# EAGLE schematic schematic (EAGLE 9.5.2)
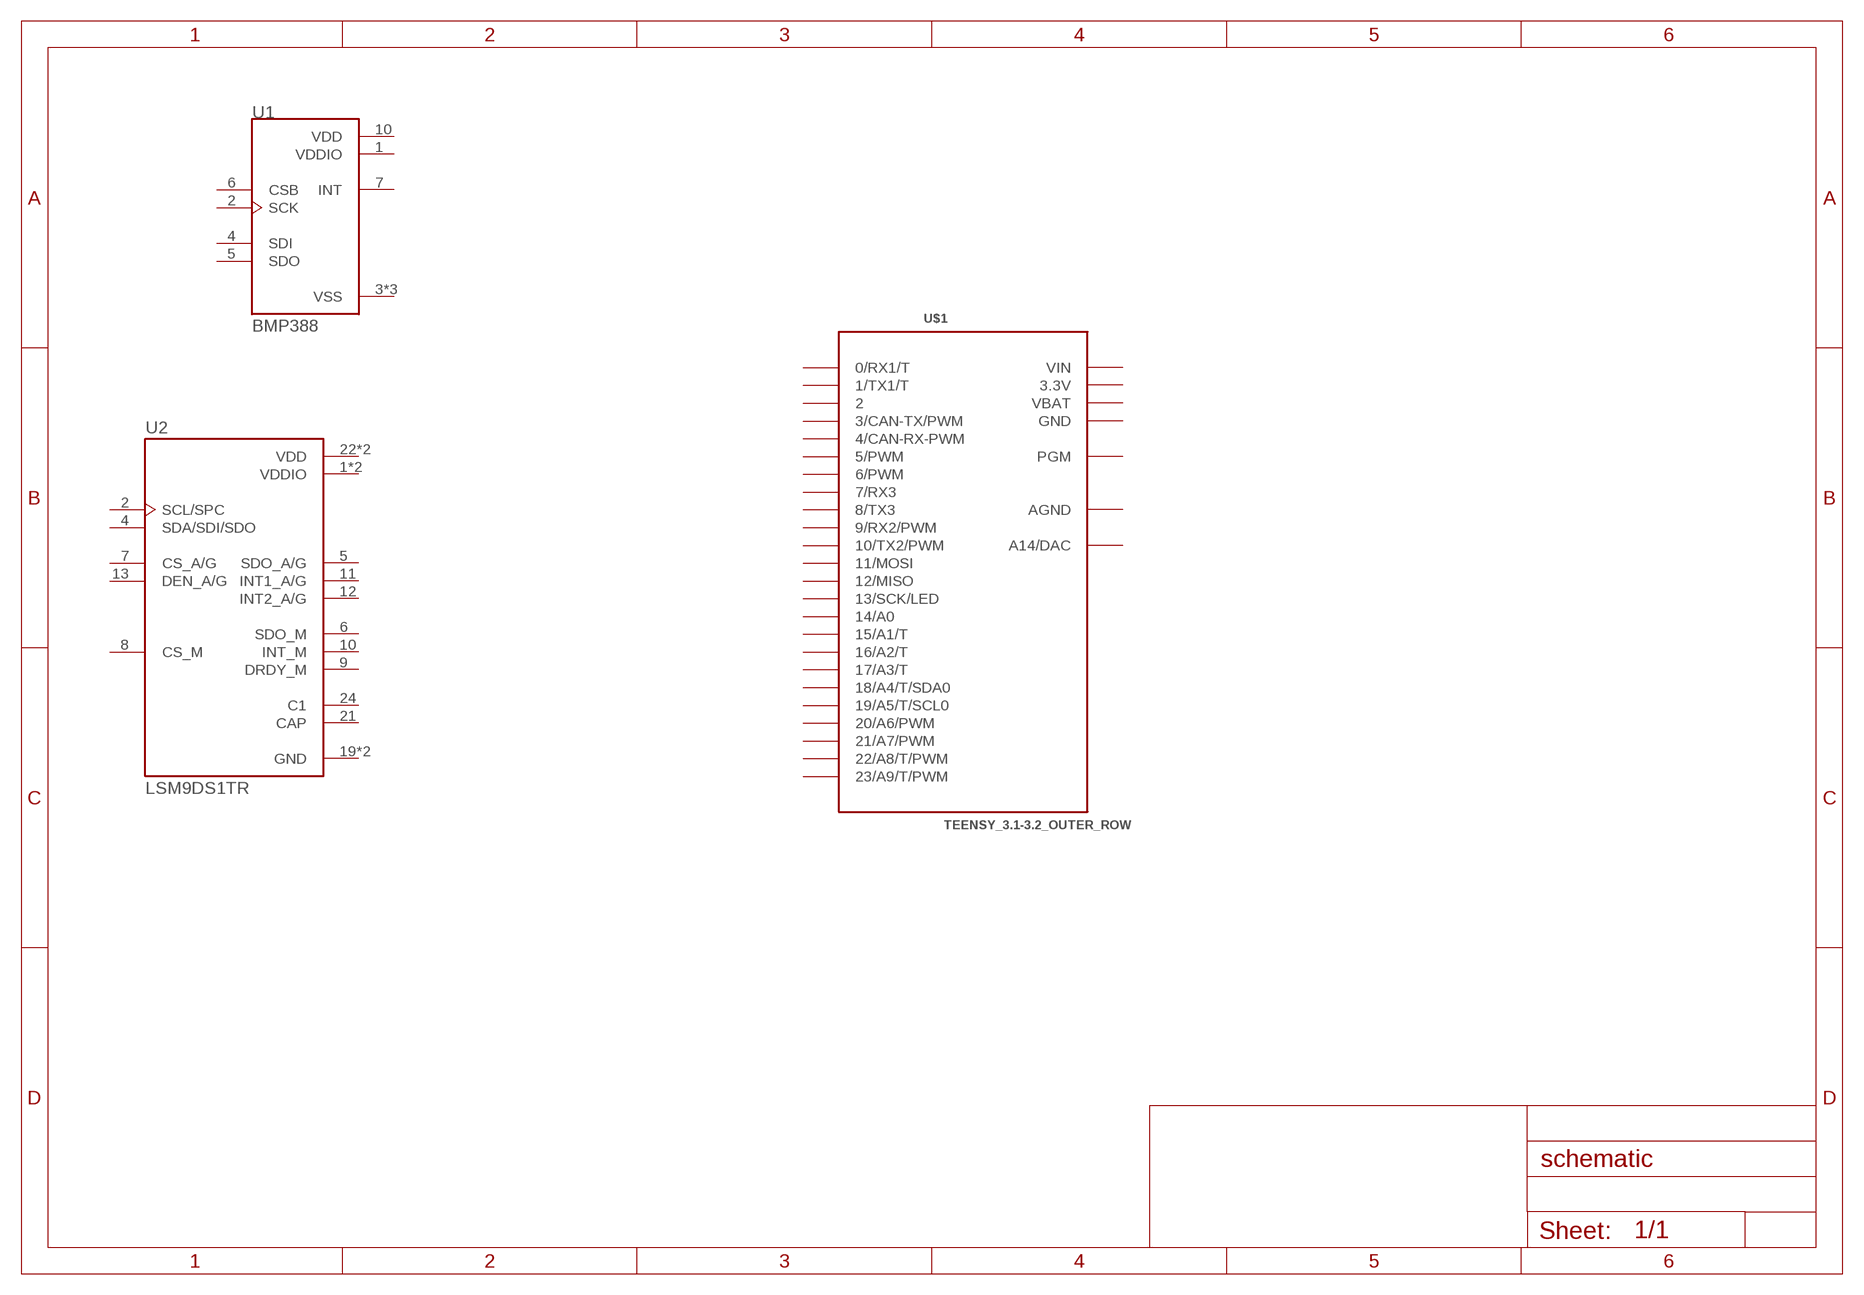
[diagram p0: schematic, sheet 1]

## Parts
U1  BMP388  [PQFN50P200X200X80-10N]
U2  LSM9DS1TR  [PQFN43P300X350X102-24N]
U$1  TEENSY_3.1-3.2_OUTER_ROW  [TEENSY_3.0-3.2&LC_OUTER_ROW]
Unconnected: U1.2(SCK) U1.4(SDI) U1.5(SDO) U1.6(CSB) U1.7(INT) U2.2(SCL/SPC) U2.4(SDA/SDI/SDO) U2.5(SDO_A/G) U2.6(SDO_M) U2.7(CS_A/G) U2.8(CS_M) U2.9(DRDY_M) U2.10(INT_M) U2.11(INT1_A/G) U2.12(INT2_A/G) U2.13(DEN_A/G) U2.21(CAP) U2.24(C1) U$1.0(0/RX1/T) U$1.1(1/TX1/T) U$1.2 U$1.3(3/CAN-TX/PWM) U$1.4(4/CAN-RX-PWM) U$1.5(5/PWM) U$1.6(6/PWM) U$1.7(7/RX3) U$1.8(8/TX3) U$1.9(9/RX2/PWM) U$1.10(10/TX2/PWM) U$1.11(11/MOSI) U$1.12(12/MISO) U$1.13(13/SCK/LED) U$1.14/A0 U$1.15/A1(15/A1/T) U$1.16/A2(16/A2/T) U$1.17/A3(17/A3/T) U$1.18/A4(18/A4/T/SDA0) U$1.19/A5(19/A5/T/SCL0) U$1.20/A6(20/A6/PWM) U$1.21/A7(21/A7/PWM) U$1.22/A8(22/A8/T/PWM) U$1.23/A9(23/A9/T/PWM) U$1.PGM U$1.RESET/DAC(A14/DAC)

## Power pins joined to a net without a drawn wire
3.3V: U$1.3.3V U$1.3.3V1(3.3V)
AGND: U$1.AGND
GND: U2.19(GND) U2.20(GND) U$1.GND U$1.GND1(GND)
VBAT: U$1.VBAT
VDD: U1.10(VDD) U2.22(VDD) U2.23(VDD)
VDDIO: U1.1(VDDIO) U2.1(VDDIO) U2.3(VDDIO)
VIN: U$1.VIN
VSS: U1.3(VSS) U1.8(VSS) U1.9(VSS)

## Library data of the parts
U1 = BMP388:BMP388: P-Sensor SPI I2C 1, 25 Bar SMD; DESCRIPTION: P-Sensor SPI I2C 1, 25 Bar SMD; DIGI-KEY_PART_NUMBER: 828-1079-1-ND; DIGI-KEY_PURCHASE_URL: https://www.digikey.ca/product-detail/en/bosch-sensortec/BMP388/828-1079-1-ND/8322640?utm_source=snapeda&utm_medium=aggregator&utm_campaign=symbol; MF: Bosch Sensortec; MP: BMP388; PACKAGE: WFLGA-10 Bosch Tools
U2 = LSM9DS1TR:LSM9DS1TR: The LSM9DS1 is a system-in-package featuring a 3D digital linear acceleration sensor, a 3D digital angular rate sensor, and a 3D digital magnetic sensor.; DESCRIPTION: LSM9DS1 Series ±2/±4/±8/±16 g 3D Digital Linear Acceleration Sensor - LGA-24; DIGI-KEY_PART_NUMBER: 497-14946-1-ND; DIGI-KEY_PURCHASE_URL: https://www.digikey.ca/product-detail/en/stmicroelectronics/LSM9DS1TR/497-14946-1-ND/4988079?utm_source=snapeda&utm_medium=aggregator&utm_campaign=symbol; MF: STMicroelectronics; MP: LSM9DS1TR; PACKAGE: TFLGA-24 STMicroelectronics
U$1 = Teensy_3_and_LC_Series_Boards_v1.4:TEENSY_3.1-3.2_OUTER_ROW: Footprint for Teensy 3.1 or 3.2 board using all pin connections on the outer perimeter